# Altium schematic sheet esp_altimeter_evo1.SchDoc
size A3
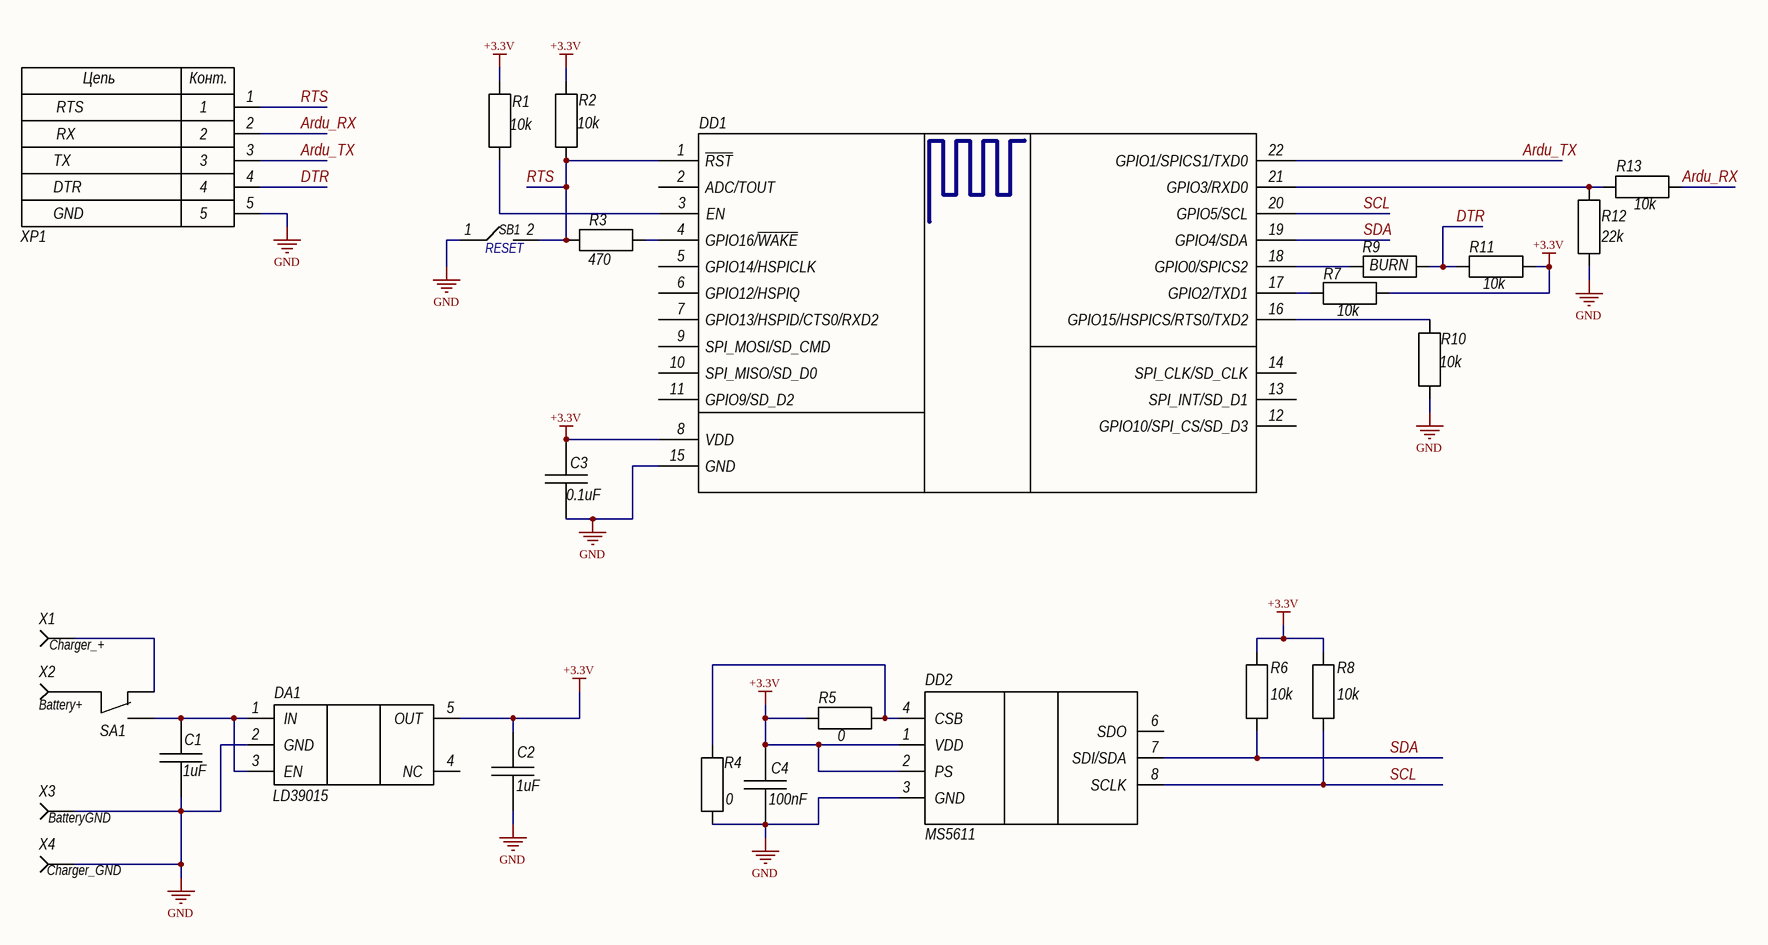
[diagram p0: esp_altimeter_evo1.SchDoc]

## Parts
C1  value 1uF  [CAP EIA 0603]  (hidden comment: Cap EIA 0603)
C2  value 1uF  [CAP EIA 0603]  (hidden comment: Cap EIA 0603)
C3  value 0.1uF  [CAP EIA 0603]  (hidden comment: Cap EIA 0603)
C4  value 100nF  [CAP EIA 0603]  (hidden comment: Cap EIA 0603)
DA1  LD39015  [SOT23-5L]
DD1  ESP8266 ESP-12E-RU  [ESP8266 ESP-12-E]  (value not drawn)
DD2  MS5611  [MS5611]
R1  value 10k  [RES EIA 0603]  (hidden comment: Res EIA 0603)
R2  value 10k  [RES EIA 0603]  (hidden comment: Res EIA 0603)
R3  value 470  [RES EIA 0603]  (hidden comment: Res EIA 0603)
R4  value 0  [RES EIA 0402]  (hidden comment: Res EIA 0402)
R5  value 0  [RES EIA 0402]  (hidden comment: Res EIA 0402)
R6  value 10k  [RES EIA 0603]  (hidden comment: Res EIA 0603)
R7  value 10k  [RES EIA 0603]  (hidden comment: Res EIA 0603)
R8  value 10k  [RES EIA 0603]  (hidden comment: Res EIA 0603)
R9  Name: BURN  [RES EIA 0603]  (hidden comment: Res EIA 0603)
R10  value 10k  [RES EIA 0603]  (hidden comment: Res EIA 0603)
R11  value 10k  [RES EIA 0603]  (hidden comment: Res EIA 0603)
R12  value 22k  [RES EIA 0603]  (hidden comment: Res EIA 0603)
R13  value 10k  [RES EIA 0603]  (hidden comment: Res EIA 0603)
SA1  IS-1290  [IS-1290F]  (value not drawn)
SB1  RESET  [SB_Pad]
X1  Charger_+  [Surface_Pad]
X2  Battery+  [Surface_Pad]
X3  BatteryGND  [Surface_Pad]
X4  Charger_GND  [Surface_Pad]
XP1  BM05B-SRSS-TB  [BM05B-SRSS-TB]  (value not drawn)

## Nets
+3.3V: C2.2 C3.2 C4.2 DA1.5(OUT) DD1.8(VDD) DD2.1(VDD) DD2.2(PS) R1.2 R2.2 R5.1 R6.2 R7.2 R8.2 R11.2
GND: C1.1 C2.1 C3.1 C4.1 DA1.2(GND) DD1.15(GND) DD2.3(GND) R4.1 R10.1 R12.1 SB1.1(OUT) X3.1 X4.1 XP1.5
Ardu_RX: R13.2 XP1.2
Ardu_TX: DD1.22(GPIO1/SPICS1/TXD0) XP1.3
DTR: R9.2 R11.1 XP1.4
RTS: DD1.1(~{RST}) R2.1 R3.1 SB1.2(OUT) XP1.1
SCL: DD1.20(GPIO5/SCL) DD2.8(SCLK) R8.1
SDA: DD1.19(GPIO4/SDA) DD2.7(SDI/SDA) R6.1
NetC1_2: C1.2 DA1.1(IN) DA1.3(EN) SA1.1
NetDD1_3: DD1.3(EN) R1.1
NetDD1_4: DD1.4(GPIO16/~{WAKE}) R3.2
NetDD1_16: DD1.16(GPIO15/HSPICS/RTS0/TXD2) R10.2
NetDD1_17: DD1.17(GPIO2/TXD1) R7.1
NetDD1_18: DD1.18(GPIO0/SPICS2) R9.1
NetDD1_21: DD1.21(GPIO3/RXD0) R12.2 R13.1
NetDD2_4: DD2.4(CSB) R4.2 R5.2
NetSA1_2: SA1.2 X2.1
NetSA1_3: SA1.3 X1.1

Not connected (* = marked no-connect by the designer): DA1 4(NC); DD1 2(ADC/TOUT) 5(GPIO14/HSPICLK) 6(GPIO12/HSPIQ) 7(GPIO13/HSPID/CTS0/RXD2) 9(SPI_MOSI/SD_CMD) 10(SPI_MISO/SD_D0) 11(GPIO9/SD_D2) 12(GPIO10/SPI_CS/SD_D3) 13(SPI_INT/SD_D1) 14(SPI_CLK/SD_CLK); DD2 5(CSB) 6(SDO)

## Notes on the sheet
- RTS
- RX
- TX
- DTR
- GND
- (in symbol BM05B-SRSS-TB) Цепь; Конт.

## Library data of the parts
C1-C4 = Cap EIA 0603: Group: Конденсаторы; Manufacturer: *; Name: *; Supplier: *
DD1 = ESP8266 ESP-12E-RU: Manufacturer: Espressif; Group: Microcontrollers; Name: ESP8266-12E; Documentation: https://www.espressif.com/sites/default/files/documentation/0a-esp8266ex_datasheet_en.pdf; Price: 1,7$
R1-R3 R6-R8 R10-R13 = Res EIA 0603: Group: Резисторы; Manufacturer: *; Name: *; Supplier: *
R4 R5 = Res EIA 0402: Group: Резисторы; Manufacturer: *; Name: *; Supplier: *
R9 = Res EIA 0603: Group: Резисторы; Value: 10k; Manufacturer: *; Supplier: *
SA1 = IS-1290: Group: Переключатели; Manufacturer: *; Name: IS-1290; Supplier: *; Value: *
SB1 = SB_Pad
X1-X4 = Surface_Pad
XP1 = BM05B-SRSS-TB: 5-Pin Angle Connector; Manufacturer: JST; Group: Разъемы; Value: Разъем штыревой 5-и контактный угловой; Name: BM05B-SRSS-TB; Supplier: ООО"Компэл"